# Altium schematic sheet USART.SchDoc
size A4
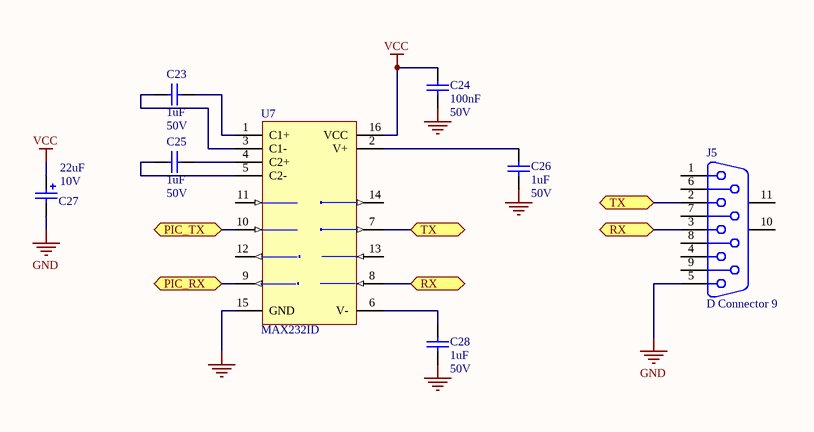
[diagram p0: USART.SchDoc]

## Parts
C23  value 1uF  Voltage: 50V  [3-0603_L]  (hidden comment: Cap)
C24  value 100nF  Voltage: 50V  [3-0603_L]  (hidden comment: Cap)
C25  value 1uF  Voltage: 50V  [3-0603_L]  (hidden comment: Cap)
C26  value 1uF  Voltage: 50V  [3-0603_L]  (hidden comment: Cap)
C27  value 22uF  Voltage: 10V  [3528]  (hidden comment: CAP-Tantal)
C28  value 1uF  Voltage: 50V  [3-0603_L]  (hidden comment: Cap)
J5  D Connector 9  [DSUB1.385-2H9]
U7  MAX232ID  [SOIC16 - big]

## Ports
PIC_RX (bidir), PIC_TX (bidir), RX (bidir), TX (bidir)

## Nets
GND: C24.1 C26.2 C27.2 C28.2 J5.5 U7.15(GND)
VCC: C24.2 C27.1 U7.16(VCC)
PIC_RX: U7.9(R2OUT) ; port PIC_RX
PIC_TX: U7.10(T2IN) ; port PIC_TX
RX: J5.3 U7.8(R2IN) ; port RX
TX: J5.2 U7.7(T2OUT) ; port TX
NetC23_1: C23.1 U7.1(C1+)
NetC23_2: C23.2 U7.3(C1-)
NetC25_1: C25.1 U7.4(C2+)
NetC25_2: C25.2 U7.5(C2-)
NetC26_1: C26.1 U7.2(V+)
NetC28_1: C28.1 U7.6(V-)

Not connected (* = marked no-connect by the designer): J5 1 4 6 7 8 9 10(MH1) 11(MH2); U7 11(T1IN) 12(R1OUT) 13(R1IN) 14(T1OUT)

## Library data of the parts
C23-C26 C28 = Cap: Capacitor; Published: 8-Jun-2000; Revision: July-2002: Re-released for DXP Platform.; Publisher: Altium Limited
C27 = CAP-Tantal: Tantamount Military, Surface Mount MIL-PRF-55365/8 Qualified Solid Tantalum Chip Capacitor: 6.8uF, 20% Tolerance, 6 WVDC @ +85°C, Surge = 8V; Note: See Data Sheet for full range of components; Published: 19-Mar-2004; DatasheetDocument: 20-Mar-2003; PackageReference: 3528; Publisher: Altium Limited; Code_JEITA: 3528; ComponentLink1Description: Manufacturer Link; ComponentLink1URL: http://www.vishay.com/; ComponentLink2Description: Datasheet; ComponentLink2URL: http://www.vishay.com/docs/40011/cwr11.pdf
J5 = D Connector 9: Receptacle Assembly, 9 Position, Right Angle; PackageDocument: O; Positions: 9; Published: 15-Jun-2001; LatestRevisionDate: 17-Jul-2002; LatestRevisionNote: Re-released for DXP Platform.; DatasheetDocument: 1-Sep-1999; PackageReference: 788750; Publisher: Altium Limited; Orientation: Right Angle; Gender: Receptacle
U7 = MAX232ID: 5V, Low-Power, up to 1Mbps, True RS-232 Transceiver Using Four 0.1µF External Capacitor; Code - JEDEC: MS-012-AC; Code - IPC: SO16; Published: 16-Jan-2001; Revision: 17-Jul-2002: Re-released for DXP Platform.; Datasheet: Latest Revision: Mar-1999; Package Reference: NSO16; Publisher: Altium Limited